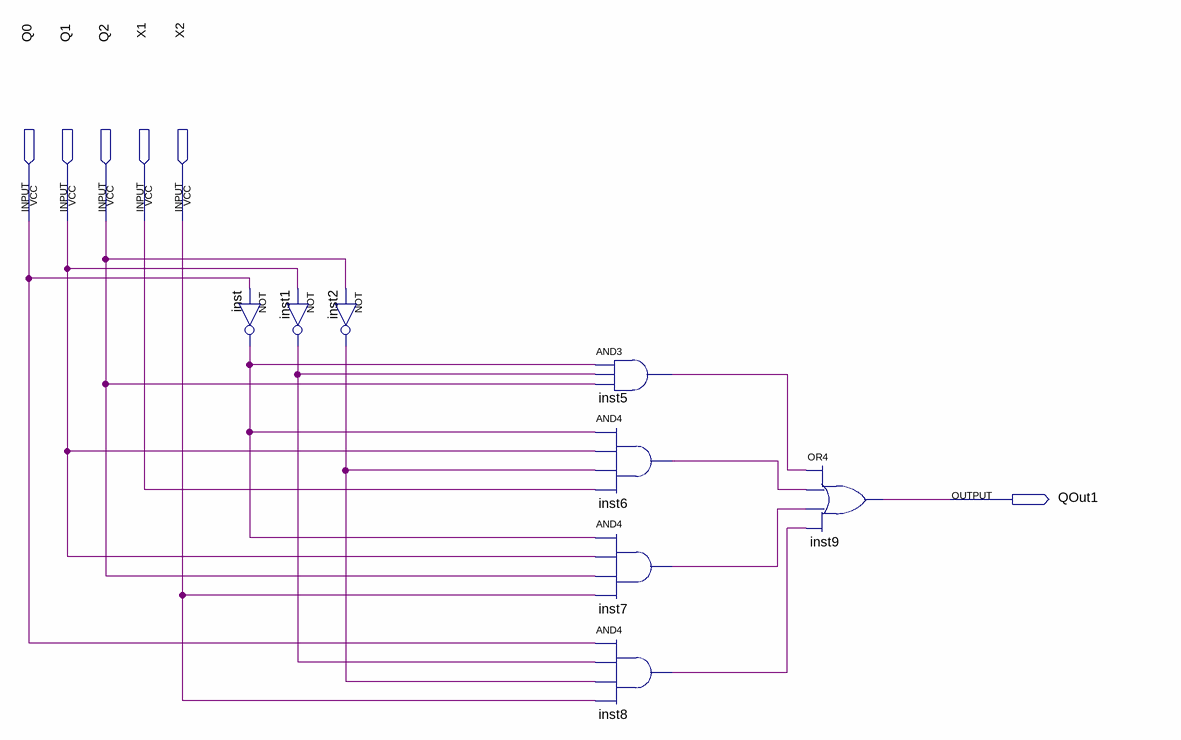
[diagram p0: schematic sheet]
// Quartus schematic M_q1.bdf as structural Verilog: 8 symbols, 6 pins
module M_q1 (
  input  Q0,
  input  Q1,
  input  Q2,
  input  X1,
  input  X2,
  output QOut1
);

  wire inst1_out, inst2_out, inst5_out, inst6_out, inst7_out, inst8_out, inst_out;

  not inst (inst_out, Q0);
  not inst1 (inst1_out, Q1);
  not inst2 (inst2_out, Q2);
  and inst5 (inst5_out, inst_out, inst1_out, Q2);
  and inst6 (inst6_out, inst_out, Q1, inst2_out, X1);
  and inst7 (inst7_out, inst_out, Q1, Q2, X2);
  and inst8 (inst8_out, Q0, inst1_out, inst2_out, X2);
  or inst9 (QOut1, inst5_out, inst6_out, inst7_out, inst8_out);
endmodule
